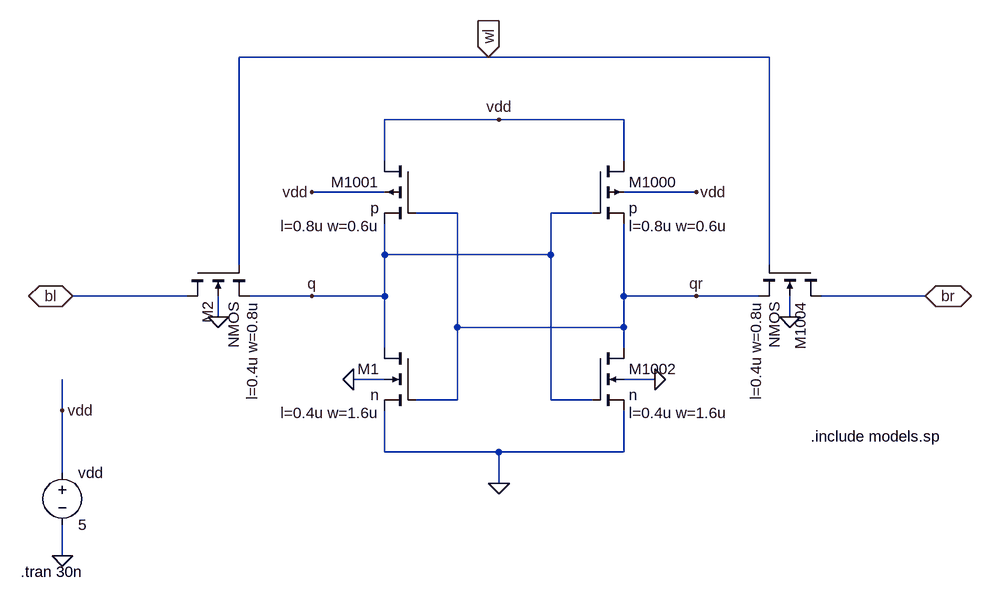
[diagram p0: schematic cell_1rw.asc]
cell_1rw.asc, the LTspice schematic file:
Version 4
SHEET 1 916 728
WIRE 160 -80 -224 -80
WIRE 592 -80 160 -80
WIRE 176 16 0 16
WIRE 368 16 176 16
WIRE 0 80 0 16
WIRE 368 80 368 16
WIRE 0 128 -112 128
WIRE 480 128 368 128
WIRE 112 160 48 160
WIRE 320 160 256 160
WIRE 0 224 0 176
WIRE 256 224 256 160
WIRE 256 224 0 224
WIRE -224 240 -224 -80
WIRE 592 240 592 -80
WIRE -304 288 -480 288
WIRE -112 288 -208 288
WIRE 0 288 0 224
WIRE 0 288 -112 288
WIRE 368 288 368 176
WIRE 480 288 368 288
WIRE 576 288 480 288
WIRE 832 288 672 288
WIRE -256 320 -256 288
WIRE 624 320 624 288
WIRE 112 336 112 160
WIRE 368 336 368 288
WIRE 368 336 112 336
WIRE 0 368 0 288
WIRE 368 368 368 336
WIRE 0 416 -48 416
WIRE 416 416 368 416
WIRE 112 448 112 336
WIRE 112 448 48 448
WIRE 256 448 256 224
WIRE 320 448 256 448
WIRE -496 464 -496 416
WIRE 0 528 0 464
WIRE 176 528 0 528
WIRE 368 528 368 464
WIRE 368 528 176 528
WIRE -496 560 -496 464
WIRE 176 576 176 528
WIRE -496 688 -496 640
FLAG 176 576 0
FLAG -496 688 0
FLAG -496 464 vdd
FLAG 176 16 vdd
FLAG 416 416 0
FLAG -48 416 0
FLAG 624 320 0
FLAG -256 320 0
FLAG -112 128 vdd
FLAG 480 128 vdd
FLAG -480 288 bl
IOPIN -480 288 BiDir
FLAG 160 -80 wl
IOPIN 160 -80 In
FLAG 832 288 br
IOPIN 832 288 BiDir
FLAG -112 288 q
FLAG 480 288 qr
SYMBOL pmos4 320 80 R0
WINDOW 123 56 100 Left 2
SYMATTR Value2 l=0.8u w=0.6u
SYMATTR InstName M1000
SYMATTR Value p
SYMBOL pmos4 48 80 M0
WINDOW 123 56 100 Left 2
SYMATTR Value2 l=0.8u w=0.6u
SYMATTR InstName M1001
SYMATTR Value p
SYMBOL nmos4 320 368 R0
WINDOW 123 56 100 Left 2
SYMATTR Value2 l=0.4u w=1.6u
SYMATTR InstName M1002
SYMATTR Value n
SYMBOL nmos4 48 368 M0
WINDOW 123 56 100 Left 2
SYMATTR Value2 l=0.4u w=1.6u
SYMATTR InstName M1
SYMATTR Value n
SYMBOL voltage -496 544 R0
WINDOW 123 0 0 Left 0
WINDOW 39 0 0 Left 0
SYMATTR InstName vdd
SYMATTR Value 5
SYMBOL nmos4 672 240 R90
WINDOW 123 56 100 Left 2
SYMATTR Value2 l=0.4u w=0.8u
SYMATTR InstName M1004
SYMBOL nmos4 -304 240 M90
WINDOW 123 56 100 Left 2
SYMATTR Value2 l=0.4u w=0.8u
SYMATTR InstName M2
TEXT 656 504 Left 2 !.include models.sp
TEXT -560 712 Left 2 !.tran 30n

The netlist it stands for:
* cell_1rw.asc
M1000 vdd q qr vdd p l=0.8u w=0.6u
M1001 vdd qr q vdd p l=0.8u w=0.6u
M1002 qr q 0 0 n l=0.4u w=1.6u
M1 q qr 0 0 n l=0.4u w=1.6u
vdd vdd 0 5
M1004 br wl qr 0 NMOS l=0.4u w=0.8u
M2 bl wl q 0 NMOS l=0.4u w=0.8u
.model NMOS NMOS
.model PMOS PMOS
.lib standard.mos
.include models.sp
.tran 30n
.backanno
.end